# EAGLE design Snowman (EAGLE 6.3)
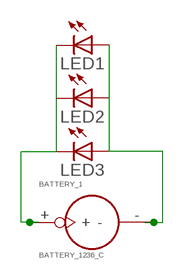
[diagram p0: schematic, sheet 1]

## Parts
BATTERY_1  BATTERY_1236_C  [BATTERY_1236_C]
LED1  LED5MM  [LED5MM]
LED2  LED5MM  [LED5MM]
LED3  LED5MM  [LED5MM]

## Nets
N$1: BATTERY_1.+ LED1.K(C) LED2.K(C) LED3.K(C)
N$3: BATTERY_1.- LED1.A LED2.A LED3.A

## Library data of the parts
BATTERY_1 = Itead_BP_110825:BATTERY_1236_C: SOC004
LED1-LED3 = SparkFun-LED:LED: LEDs Standard schematic elements and footprints for 5mm, 3mm, 1206, and 0603 sized LEDs. 5mm - Spark Fun Electronics SKU : COM-00529 (and others)

## Board
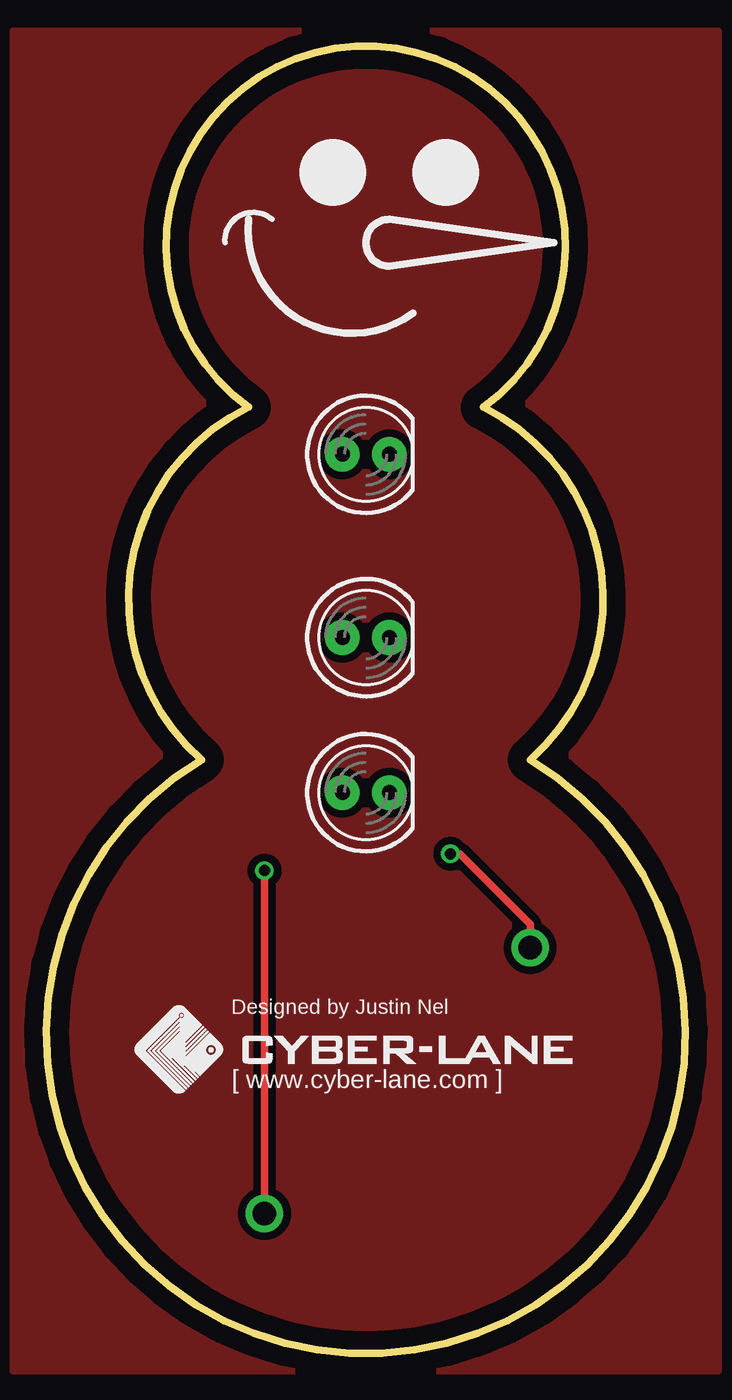
[diagram p1: board, top side]
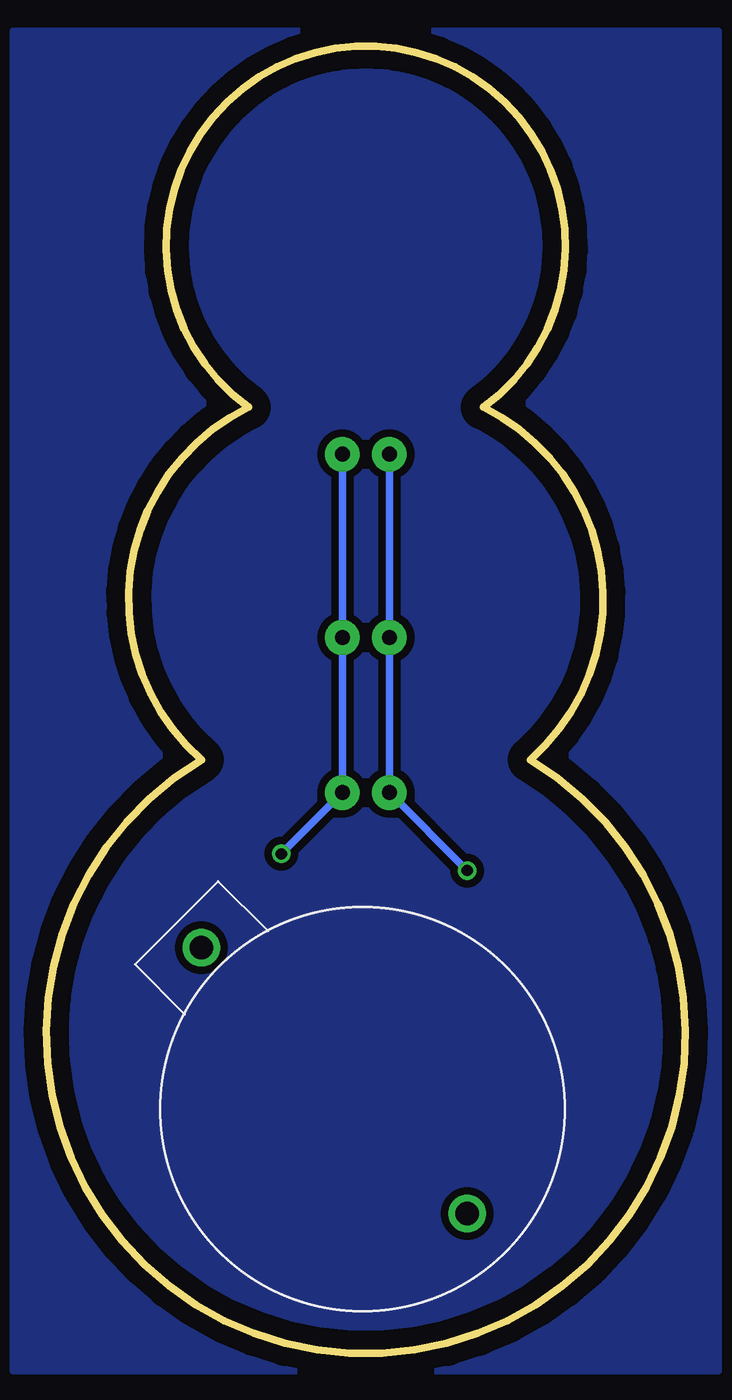
[diagram p2: board, bottom side, seen from below]

Size 34.56 x 70.64 mm. Coordinates in mm from the lower left corner, seen from the top.
Outline: 8.39,32.07 arc298 26.17,32.07 arc113 23.63,51.12 arc288 10.93,51.12 arc113 8.39,32.07
Copper layers (1*16): Top 0.035mm / dielectric 1.5mm / Bottom 0.035mm
Design rules "default": minimum track width 10mil, minimum drill 24mil, track to track 8mil, track to pad 8mil, pad to pad 8mil, via to via 8mil, smd to smd 8mil, copper to edge 40mil, drill to drill 8mil, minimum pad ring 10mil, minimum via ring 8mil, stop-mask expansion 4mil, vias tented up to drill 0mil, thermal gap 10mil

### Footprints (pad centres in the part's own frame; a part is rotated, then mirrored left to right if it is on the bottom)
BATTERY_1236_C = drill 1.27 pad 2.032: + 0,0; - 0,20.32
LED5MM = drill 0.813 pad 1.88: A -1.27,0; K 1.27,0

### Placement (x,y rotation side)
BATTERY_1  26.17,21.91 225 bottom
LED1  17.28,30.3 0 top
LED2  17.28,38.68 0 top
LED3  17.28,48.58 0 top

### Tracks (layer width: path | path; a pad name or v marks a point on that pad's centre or on a via)
GND
  pour Top (isolate 0.406): -0.5,-0.95 36.33,-0.95 36.33,0.32 36.33,71.44 -1.77,71.44 -1.77,70.17 -1.77,-0.95
  pour Bottom (isolate 0.406): -1.77,-0.95 36.33,-0.95 36.33,71.44 -1.77,71.44
N$1  (via drill 0.6)
  Top 0.406: BATTERY_1.+ 26.17,23.18 22.36,26.99 v21.85,26.99
  Bottom 0.406: v21.85,26.99 LED1.K LED2.K LED3.K
N$3  (via drill 0.6)
  Top 0.406: BATTERY_1.- v11.8,26.09
  Bottom 0.406: v11.8,26.09 LED1.A LED2.A LED3.A

### Text on the board
tPlace: Designed by Justin Nel | [ www.cyber-lane.com ]